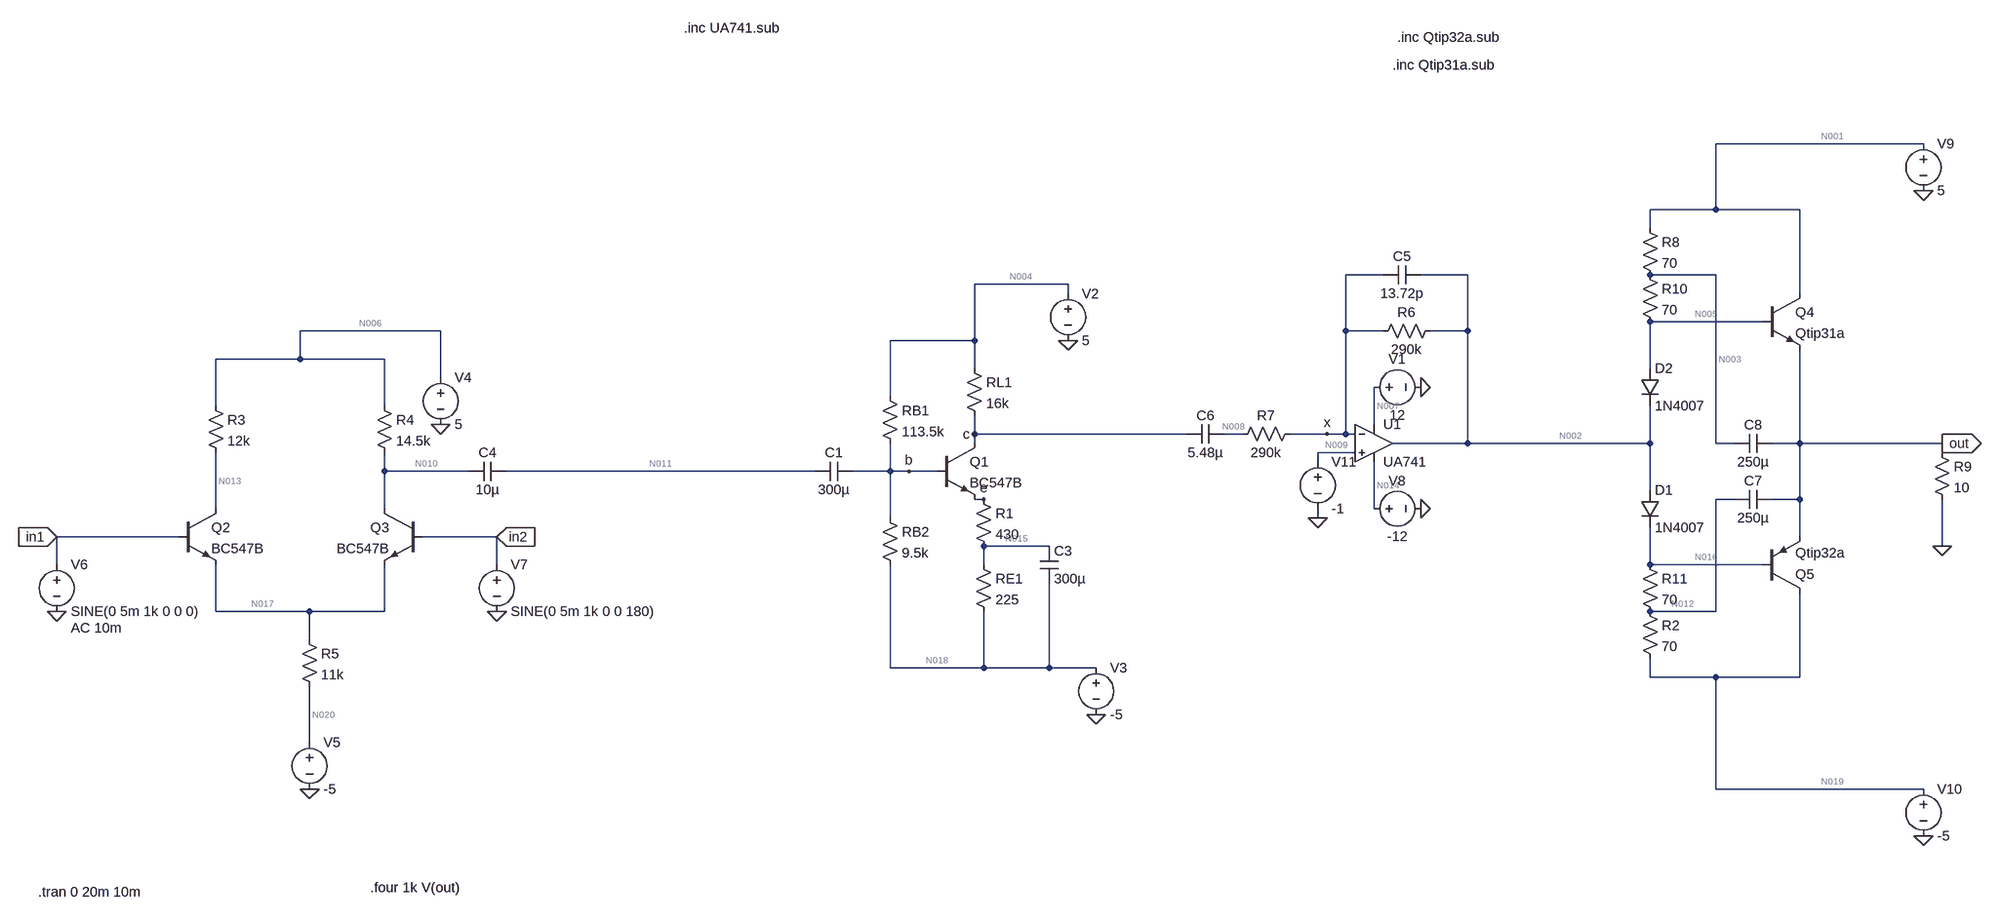
[diagram p0: schematic Full Circuit Analysis Simulation.asc]
Full Circuit Analysis Simulation.asc, the LTspice schematic file:
Version 4.1
SHEET 1 1616 680
WIRE 1488 -752 1088 -752
WIRE 1088 -640 1088 -752
WIRE 1088 -640 976 -640
WIRE 1232 -640 1088 -640
WIRE 976 -608 976 -640
WIRE 240 -528 176 -528
WIRE 384 -528 304 -528
WIRE 1088 -528 976 -528
WIRE -512 -512 -672 -512
WIRE -512 -496 -512 -512
WIRE 1232 -496 1232 -640
WIRE 1168 -448 976 -448
WIRE -1584 -432 -1824 -432
WIRE 176 -432 176 -528
WIRE 240 -432 176 -432
WIRE 384 -432 384 -528
WIRE 384 -432 320 -432
WIRE -672 -416 -672 -512
WIRE -672 -416 -816 -416
WIRE -1824 -384 -1824 -432
WIRE -1824 -384 -1968 -384
WIRE -1680 -384 -1824 -384
WIRE -672 -368 -672 -416
WIRE 976 -368 976 -448
WIRE -1584 -352 -1584 -432
WIRE -816 -320 -816 -416
WIRE -1968 -304 -1968 -384
WIRE -1680 -304 -1680 -384
WIRE 224 -272 224 -336
WIRE -672 -256 -672 -288
WIRE -96 -256 -672 -256
WIRE 0 -256 -32 -256
WIRE 144 -256 80 -256
WIRE 176 -256 176 -432
WIRE 176 -256 144 -256
WIRE 192 -256 176 -256
WIRE -672 -240 -672 -256
WIRE 384 -240 384 -432
WIRE 384 -240 256 -240
WIRE 976 -240 976 -304
WIRE 976 -240 384 -240
WIRE 1088 -240 1088 -528
WIRE 1120 -240 1088 -240
WIRE 1232 -240 1232 -400
WIRE 1232 -240 1184 -240
WIRE 1520 -240 1232 -240
WIRE 192 -224 128 -224
WIRE 1520 -224 1520 -240
WIRE 128 -208 128 -224
WIRE -1680 -192 -1680 -224
WIRE -1536 -192 -1680 -192
WIRE -944 -192 -1472 -192
WIRE -816 -192 -816 -240
WIRE -816 -192 -880 -192
WIRE -784 -192 -816 -192
WIRE -736 -192 -784 -192
WIRE 976 -160 976 -240
WIRE -656 -144 -672 -144
WIRE 1120 -144 1088 -144
WIRE 1232 -144 1232 -240
WIRE 1232 -144 1184 -144
WIRE -1968 -128 -1968 -224
WIRE -1680 -128 -1680 -192
WIRE 224 -128 224 -208
WIRE -816 -112 -816 -192
WIRE 128 -112 128 -128
WIRE -2032 -80 -2240 -80
WIRE -1488 -80 -1616 -80
WIRE 1232 -80 1232 -144
WIRE -544 -64 -656 -64
WIRE 1520 -64 1520 -144
WIRE -2240 -32 -2240 -80
WIRE -1488 -32 -1488 -80
WIRE -656 -32 -656 -64
WIRE 976 -32 976 -96
WIRE 1168 -32 976 -32
WIRE -1968 48 -1968 -32
WIRE -1808 48 -1968 48
WIRE -1680 48 -1680 -32
WIRE -1680 48 -1808 48
WIRE 1088 48 1088 -144
WIRE 1088 48 976 48
WIRE -1808 96 -1808 48
WIRE -816 144 -816 -32
WIRE -656 144 -656 48
WIRE -656 144 -816 144
WIRE -544 144 -544 0
WIRE -544 144 -656 144
WIRE -464 144 -544 144
WIRE 976 160 976 128
WIRE 1088 160 976 160
WIRE 1232 160 1232 16
WIRE 1232 160 1088 160
WIRE -1808 272 -1808 176
WIRE 1088 352 1088 160
WIRE 1488 352 1088 352
FLAG -512 -416 0
FLAG -464 224 0
FLAG -784 -192 b
FLAG -656 -144 e
FLAG -672 -256 c
FLAG -1584 -272 0
FLAG -1808 352 0
FLAG -2240 48 0
FLAG -1488 48 0
FLAG 304 -336 0
FLAG 304 -128 0
FLAG 144 -256 x
FLAG 128 -112 0
FLAG 1520 -64 0
FLAG 1488 -672 0
FLAG 1488 432 0
FLAG 1520 -240 out
IOPIN 1520 -240 Out
FLAG -2240 -80 in1
IOPIN -2240 -80 In
FLAG -1488 -80 in2
IOPIN -1488 -80 In
SYMBOL cap -880 -208 R90
WINDOW 0 0 32 VBottom 2
WINDOW 3 32 32 VTop 2
SYMATTR InstName C1
SYMATTR Value 300µ
SYMBOL res -832 -336 R0
SYMATTR InstName RB1
SYMATTR Value 113.5k
SYMBOL res -832 -128 R0
SYMATTR InstName RB2
SYMATTR Value 9.5k
SYMBOL npn -736 -240 R0
SYMATTR InstName Q1
SYMATTR Value BC547B
SYMBOL res -688 -384 R0
SYMATTR InstName RL1
SYMATTR Value 16k
SYMBOL voltage -512 -512 R0
WINDOW 123 0 0 Left 0
WINDOW 39 0 0 Left 0
SYMATTR InstName V2
SYMATTR Value 5
SYMBOL cap -560 -64 R0
SYMATTR InstName C3
SYMATTR Value 300µ
SYMBOL voltage -464 128 R0
WINDOW 123 0 0 Left 0
WINDOW 39 0 0 Left 0
SYMATTR InstName V3
SYMATTR Value -5
SYMBOL res -672 -48 R0
SYMATTR InstName RE1
SYMATTR Value 225
SYMBOL res -672 -160 R0
SYMATTR InstName R1
SYMATTR Value 430
SYMBOL npn -2032 -128 R0
SYMATTR InstName Q2
SYMATTR Value BC547B
SYMBOL npn -1616 -128 M0
SYMATTR InstName Q3
SYMATTR Value BC547B
SYMBOL res -1984 -320 R0
SYMATTR InstName R3
SYMATTR Value 12k
SYMBOL res -1696 -320 R0
SYMATTR InstName R4
SYMATTR Value 14.5k
SYMBOL voltage -1584 -368 R0
WINDOW 123 0 0 Left 0
WINDOW 39 0 0 Left 0
SYMATTR InstName V4
SYMATTR Value 5
SYMBOL cap -1472 -208 R90
WINDOW 0 0 32 VBottom 2
WINDOW 3 32 32 VTop 2
SYMATTR InstName C4
SYMATTR Value 10µ
SYMBOL res -1824 80 R0
SYMATTR InstName R5
SYMATTR Value 11k
SYMBOL voltage -1808 256 R0
WINDOW 123 0 0 Left 0
WINDOW 39 0 0 Left 0
SYMATTR InstName V5
SYMATTR Value -5
SYMBOL voltage -2240 -48 R0
WINDOW 123 24 124 Left 2
WINDOW 39 0 0 Left 0
SYMATTR Value2 AC 10m
SYMATTR InstName V6
SYMATTR Value SINE(0 5m 1k 0 0 0)
SYMBOL voltage -1488 -48 R0
WINDOW 123 0 0 Left 0
WINDOW 39 0 0 Left 0
SYMATTR InstName V7
SYMATTR Value SINE(0 5m 1k 0 0 180)
SYMBOL OpAmps\\opamp2 224 -304 R0
SYMATTR InstName U1
SYMATTR Value UA741
SYMBOL voltage 208 -336 R270
WINDOW 0 32 56 VTop 2
WINDOW 3 -32 56 VBottom 2
WINDOW 123 0 0 Left 0
WINDOW 39 0 0 Left 0
SYMATTR InstName V1
SYMATTR Value 12
SYMBOL voltage 208 -128 R270
WINDOW 0 32 56 VTop 2
WINDOW 3 -32 56 VBottom 2
WINDOW 123 0 0 Left 0
WINDOW 39 0 0 Left 0
SYMATTR InstName V8
SYMATTR Value -12
SYMBOL res 336 -448 R90
WINDOW 0 0 56 VBottom 2
WINDOW 3 32 56 VTop 2
SYMATTR InstName R6
SYMATTR Value 290k
SYMBOL cap 304 -544 R90
WINDOW 0 0 32 VBottom 2
WINDOW 3 32 32 VTop 2
SYMATTR InstName C5
SYMATTR Value 13.72p
SYMBOL res 96 -272 R90
WINDOW 0 0 56 VBottom 2
WINDOW 3 32 56 VTop 2
SYMATTR InstName R7
SYMATTR Value 290k
SYMBOL cap -32 -272 R90
WINDOW 0 0 32 VBottom 2
WINDOW 3 32 32 VTop 2
SYMATTR InstName C6
SYMATTR Value 5.48µ
SYMBOL res 960 32 R0
SYMATTR InstName R2
SYMATTR Value 70
SYMBOL res 960 -624 R0
SYMATTR InstName R8
SYMATTR Value 70
SYMBOL npn 1168 -496 R0
SYMATTR InstName Q4
SYMATTR Value Qtip31a
SYMBOL pnp 1168 16 M180
SYMATTR InstName Q5
SYMATTR Value Qtip32a
SYMBOL res 1504 -240 R0
SYMATTR InstName R9
SYMATTR Value 10
SYMBOL voltage 1488 -768 R0
WINDOW 123 0 0 Left 0
WINDOW 39 0 0 Left 0
SYMATTR InstName V9
SYMATTR Value 5
SYMBOL voltage 1488 336 R0
WINDOW 123 0 0 Left 0
WINDOW 39 0 0 Left 0
SYMATTR InstName V10
SYMATTR Value -5
SYMBOL diode 960 -160 R0
SYMATTR InstName D1
SYMATTR Value 1N4007
SYMBOL diode 960 -368 R0
SYMATTR InstName D2
SYMATTR Value 1N4007
SYMBOL cap 1184 -256 R90
WINDOW 0 0 32 VBottom 2
WINDOW 3 32 32 VTop 2
SYMATTR InstName C8
SYMATTR Value 250µ
SYMBOL res 960 -544 R0
SYMATTR InstName R10
SYMATTR Value 70
SYMBOL res 960 -48 R0
SYMATTR InstName R11
SYMATTR Value 70
SYMBOL cap 1184 -160 R90
WINDOW 0 0 32 VBottom 2
WINDOW 3 32 32 VTop 2
SYMATTR InstName C7
SYMATTR Value 250µ
SYMBOL voltage 128 -224 R0
SYMATTR InstName V11
SYMATTR Value -1
TEXT -2272 528 Left 2 !.tran 0 20m 10m
TEXT -1168 -1136 Left 2 !.inc UA741.sub
TEXT 256 -1072 Left 2 !.inc Qtip31a.sub
TEXT 264 -1120 Left 2 !.inc Qtip32a.sub
TEXT -1704 520 Left 2 !.four 1k V(out)

The netlist it stands for:
* Full Circuit Analysis Simulation.asc
C1 b N011 300µ
RB1 N004 b 113.5k
RB2 b N018 9.5k
Q1 c b e 0 BC547B
RL1 N004 c 16k
V2 N004 0 5
C3 N015 N018 300µ
V3 N018 0 -5
RE1 N015 N018 225
R1 e N015 430
Q2 N013 in1 N017 0 BC547B
Q3 N010 in2 N017 0 BC547B
R3 N006 N013 12k
R4 N006 N010 14.5k
V4 N006 0 5
C4 N011 N010 10µ
R5 N017 N020 11k
V5 N020 0 -5
V6 in1 0 SINE(0 5m 1k 0 0 0) AC 10m
V7 in2 0 SINE(0 5m 1k 0 0 180)
X§U1 N009 x N007 N014 N002 UA741  ; pins In+ In- V+ V- OUT
V1 N007 0 12
V8 N014 0 -12
R6 N002 x 290k
C5 N002 x 13.72p
R7 x N008 290k
C6 N008 c 5.48µ
R2 N012 N019 70
R8 N001 N003 70
Q4 N001 N005 out 0 Qtip31a
Q5 N019 N016 out 0 Qtip32a
R9 out 0 10
V9 N001 0 5
V10 N019 0 -5
D1 N002 N016 1N4007
D2 N005 N002 1N4007
C8 out N003 250µ
R10 N003 N005 70
R11 N016 N012 70
C7 out N012 250µ
V11 N009 0 -1
.model D D
.lib standard.dio
.model NPN NPN
.model PNP PNP
.lib standard.bjt
.tran 0 20m 10m
.inc UA741.sub
.inc Qtip31a.sub
.inc Qtip32a.sub
.four 1k V(out)
.backanno
.end

* Results of the author's LTspice run, read from the files saved beside the schematic
* Operating Point, zero values left out:
*   V(b) = -4.235 V
*   V(c) = 984.5 mV
*   V(e) = -4.835 V
*   V(n001) = 5 V
*   V(n002) = -976.9 mV
*   V(n003) = 2.371 V
*   V(n004) = 5 V
*   V(n005) = -258.4 mV
*   V(n006) = 5 V
*   V(n007) = 12 V
*   V(n008) = -999.9 mV
*   V(n009) = -1 V
*   V(n010) = 2.118 V
*   V(n011) = -1.249 mV
*   V(n012) = -3.337 V
*   V(n013) = 2.597 V
*   V(n014) = -12 V
*   V(n015) = -4.943 V
*   V(n016) = -1.673 V
*   V(n017) = -595.4 mV
*   V(n018) = -5 V
*   V(n019) = -5 V
*   V(n020) = -5 V
*   V(out) = -959.3 mV
*   V(x) = -999.9 mV
*   I(D1) = 19.7 mA
*   I(D2) = 35.82 mA
*   I(R1) = 251.8 µA
*   I(R10) = 37.56 mA
*   I(R11) = 23.76 mA
*   I(R2) = 23.76 mA
*   I(R3) = 200.3 µA
*   I(R4) = 198.8 µA
*   I(R5) = 400.4 µA
*   I(R6) = 79.41 nA
*   I(R8) = 37.56 mA
*   I(R9) = -95.93 mA
*   I(RB1) = 81.36 µA
*   I(RB2) = 80.55 µA
*   I(RE1) = 251.8 µA
*   I(RL1) = 251 µA
*   I(V1) = -1.335 mA
*   I(V10) = 508.6 mA
*   I(V11) = -79.29 nA
*   I(V2) = -332.3 µA
*   I(V3) = 332.3 µA
*   I(V4) = -399.1 µA
*   I(V5) = 400.4 µA
*   I(V6) = -680.2 nA
*   I(V7) = -680.3 nA
*   I(V8) = 1.335 mA
*   I(V9) = -428.8 mA
*   Ib(Q1) = 818.6 nA
*   Ib(Q2) = 680.2 nA
*   Ib(Q3) = 680.3 nA
*   Ib(Q4) = 1.741 mA
*   Ib(Q5) = -4.064 mA
*   Ic(Q1) = 251 µA
*   Ic(Q2) = 200.3 µA
*   Ic(Q3) = 198.8 µA
*   Ic(Q4) = 391.3 mA
*   Ic(Q5) = -484.9 mA
*   Ie(Q1) = -251.8 µA
*   Ie(Q2) = -201 µA
*   Ie(Q3) = -199.5 µA
*   Ie(Q4) = -393 mA
*   Ie(Q5) = 488.9 mA
*   Ix(u1:1) = 79.29 nA
*   Ix(u1:2) = 79.41 nA
*   Ix(u1:3) = 1.335 mA
*   Ix(u1:4) = -1.335 mA
*   Ix(u1:5) = 16.12 mA
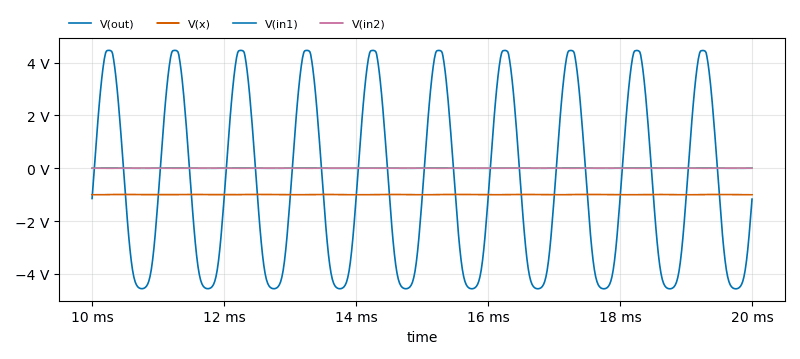
[diagram p1: Transient Analysis of Full Circuit Analysis Simulation.asc, plotted from the saved traces]
* Transient Analysis, 1 run:
*   V(out): min -4.565 V, max 4.46 V, average -528 mV, rms 3.441 V, last -1.171 V
*   V(x): min -1.007 V, max -993.2 mV, average -1 V, rms 1 V, last -1.006 V
*   V(in1): min -5 mV, max 5 mV, average 582.3 nV, rms 3.536 mV, last 0 V
*   V(in2): min -5 mV, max 5 mV, average -582.3 nV, rms 3.536 mV, last 0 V
* From the log:
*   Fourier components of V(out)
*   N-Period=1
*   DC component:-0.535838
*   Harmonic  Frequency   Fourier   Normalized   Phase    Normalized
*    Number     [Hz]     Component   Component  [degree]  Phase [deg]
*       1      1.000e+03   4.768e+00   1.000e+00     91.64°      0.00°
*       2      2.000e+03   5.113e-01   1.072e-01   -176.38°   -268.01°
*       3      3.000e+03   2.115e-01   4.436e-02     94.04°      2.40°
*       4      4.000e+03   1.522e-02   3.191e-03     15.20°    -76.44°
*       5      5.000e+03   2.009e-02   4.213e-03    -85.33°   -176.97°
*       6      6.000e+03   2.241e-02   4.699e-03      8.78°    -82.86°
*       7      7.000e+03   1.177e-02   2.468e-03    101.90°     10.26°
*       8      8.000e+03   1.351e-02   2.833e-03   -165.47°   -257.10°
*       9      9.000e+03   9.632e-03   2.020e-03    -71.02°   -162.66°
*   Partial Harmonic Distortion: 11.633012%
*   Total Harmonic Distortion:   11.635587%